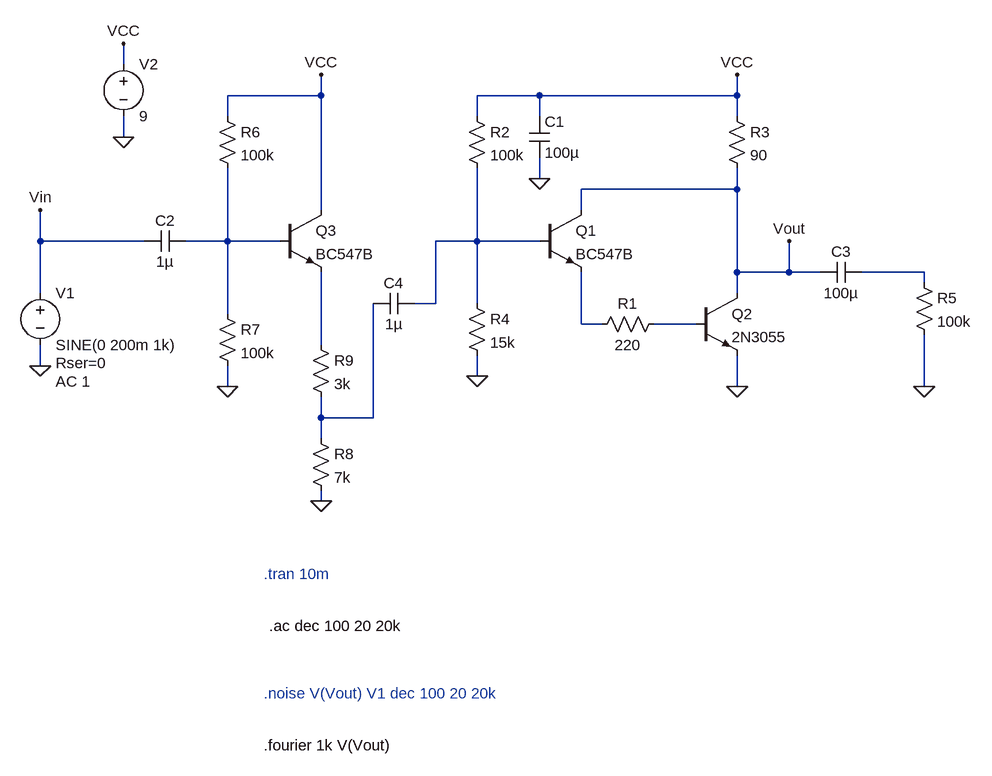
[diagram p0: schematic LAMP.asc]
LAMP.asc, the LTspice schematic file:
Version 4
SHEET 1 880 984
WIRE -528 -80 -528 -112
WIRE -224 -32 -224 -64
WIRE -224 -32 -368 -32
WIRE 112 -32 16 -32
WIRE 416 -32 416 -64
WIRE 416 -32 112 -32
WIRE -368 0 -368 -32
WIRE 16 0 16 -32
WIRE 112 0 112 -32
WIRE 416 0 416 -32
WIRE -528 32 -528 0
WIRE 112 96 112 64
WIRE 416 112 416 80
WIRE 416 112 176 112
WIRE -224 144 -224 -32
WIRE 176 144 176 112
WIRE -656 192 -656 144
WIRE -496 192 -656 192
WIRE -368 192 -368 80
WIRE -368 192 -432 192
WIRE -288 192 -368 192
WIRE 16 192 16 80
WIRE 16 192 -48 192
WIRE 112 192 16 192
WIRE 416 240 416 112
WIRE 496 240 496 192
WIRE 496 240 416 240
WIRE 544 240 496 240
WIRE 704 240 608 240
WIRE 704 256 704 240
WIRE -656 272 -656 192
WIRE 416 272 416 240
WIRE -48 288 -48 192
WIRE -48 288 -80 288
WIRE 16 288 16 192
WIRE -368 304 -368 192
WIRE 176 320 176 240
WIRE 208 320 176 320
WIRE 352 320 288 320
WIRE -224 352 -224 240
WIRE -656 384 -656 352
WIRE 16 400 16 368
WIRE -368 416 -368 384
WIRE 416 416 416 368
WIRE 704 416 704 336
WIRE -224 464 -224 432
WIRE -144 464 -144 288
WIRE -144 464 -224 464
WIRE -224 496 -224 464
WIRE -224 592 -224 576
FLAG 416 -64 VCC
FLAG 112 96 0
FLAG 416 416 0
FLAG -656 384 0
FLAG -528 32 0
FLAG -528 -112 VCC
FLAG 16 400 0
FLAG 496 192 Vout
FLAG -656 144 Vin
FLAG 704 416 0
FLAG -368 416 0
FLAG -224 592 0
FLAG -224 -64 VCC
DATAFLAG 416 112 ""
DATAFLAG -48 192 ""
SYMBOL npn 112 144 R0
SYMATTR InstName Q1
SYMATTR Value BC547B
SYMBOL npn 352 272 R0
SYMATTR InstName Q2
SYMATTR Value 2N3055
SYMBOL res 304 304 R90
WINDOW 0 0 56 VBottom 2
WINDOW 3 32 56 VTop 2
SYMATTR InstName R1
SYMATTR Value 220
SYMBOL res 0 -16 R0
SYMATTR InstName R2
SYMATTR Value 100k
SYMBOL res 400 -16 R0
SYMATTR InstName R3
SYMATTR Value 90
SYMBOL cap 96 0 R0
SYMATTR InstName C1
SYMATTR Value 100µ
SYMBOL cap -432 176 R90
WINDOW 0 0 32 VBottom 2
WINDOW 3 32 32 VTop 2
SYMATTR InstName C2
SYMATTR Value 1µ
SYMBOL voltage -656 256 R0
WINDOW 123 24 152 Left 2
WINDOW 39 24 124 Left 2
SYMATTR Value2 AC 1
SYMATTR SpiceLine Rser=0
SYMATTR InstName V1
SYMATTR Value SINE(0 200m 1k)
SYMBOL voltage -528 -96 R0
WINDOW 123 0 0 Left 0
WINDOW 39 0 0 Left 0
SYMATTR InstName V2
SYMATTR Value 9
SYMBOL res 0 272 R0
SYMATTR InstName R4
SYMATTR Value 15k
SYMBOL res 688 240 R0
SYMATTR InstName R5
SYMATTR Value 100k
SYMBOL cap 608 224 R90
WINDOW 0 0 32 VBottom 2
WINDOW 3 32 32 VTop 2
SYMATTR InstName C3
SYMATTR Value 100µ
SYMBOL npn -288 144 R0
SYMATTR InstName Q3
SYMATTR Value BC547B
SYMBOL res -384 -16 R0
SYMATTR InstName R6
SYMATTR Value 100k
SYMBOL res -384 288 R0
SYMATTR InstName R7
SYMATTR Value 100k
SYMBOL res -240 480 R0
SYMATTR InstName R8
SYMATTR Value 7k
SYMBOL cap -80 272 R90
WINDOW 0 0 32 VBottom 2
WINDOW 3 32 32 VTop 2
SYMATTR InstName C4
SYMATTR Value 1µ
SYMBOL res -240 336 R0
SYMATTR InstName R9
SYMATTR Value 3k
TEXT -312 704 Left 2 ;.tran 10m
TEXT -304 784 Left 2 !.ac dec 100 20 20k
TEXT -312 888 Left 2 ;.noise V(Vout) V1 dec 100 20 20k
TEXT -312 968 Left 2 !.fourier 1k V(Vout)

The netlist it stands for:
* LAMP.asc
Q1 Vout N002 N004 0 BC547B
Q2 Vout N005 0 0 2N3055
R1 N005 N004 220
R2 VCC N002 100k
R3 VCC Vout 90
C1 VCC 0 100µ
C2 N001 Vin 1µ
V1 Vin 0 SINE(0 200m 1k) AC 1 Rser=0
V2 VCC 0 9
R4 N002 0 15k
R5 N003 0 100k
C3 N003 Vout 100µ
Q3 VCC N001 N006 0 BC547B
R6 VCC N001 100k
R7 N001 0 100k
R8 N007 0 7k
C4 N002 N007 1µ
R9 N006 N007 3k
.model NPN NPN
.model PNP PNP
.lib standard.bjt
* .tran 10m
.ac dec 100 20 20k
* .noise V(Vout) V1 dec 100 20 20k
.fourier 1k V(Vout)
.backanno
.end